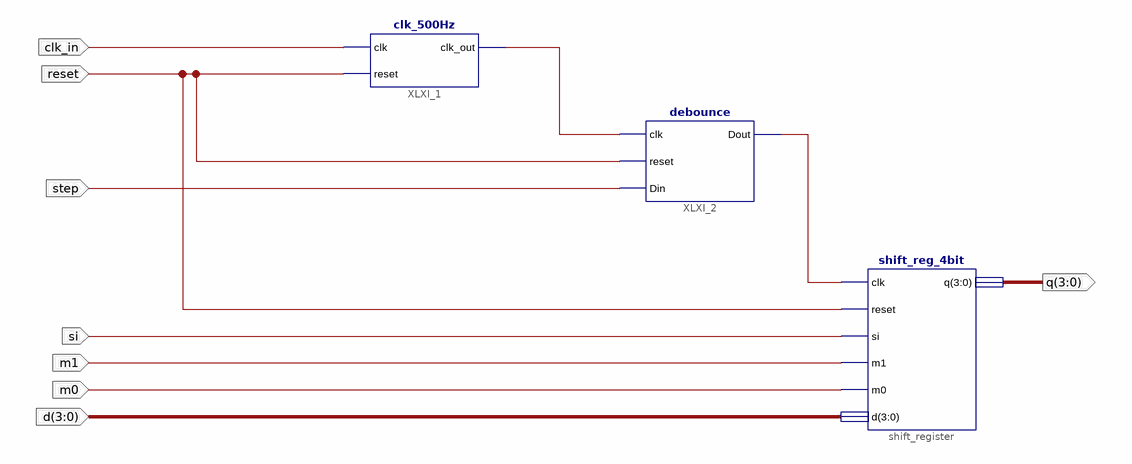
[diagram p0: schematic sheet 1]
// Xilinx ISE schematic topSchematic.sch (spartan6) as structural Verilog: 3 symbols, 8 ports
module topSchematic (
  input  clk_in,
  input  reset,
  input  step,
  input  si,
  input  m1,
  input  m0,
  input  [3:0] d,
  output [3:0] q
);

  wire XLXN_1, XLXN_2;

  clk_500Hz XLXI_1 (.clk(clk_in), .reset(reset), .clk_out(XLXN_1));
  debounce XLXI_2 (.clk(XLXN_1), .reset(reset), .Din(step), .Dout(XLXN_2));
  shift_reg_4bit shift_register (.clk(XLXN_2), .reset(reset), .si(si), .m1(m1), .m0(m0), .d(d), .q(q));
endmodule
